# EAGLE design 280113_Battery_Connector_UEBK-30256_1.0 (EAGLE 9.6.2)
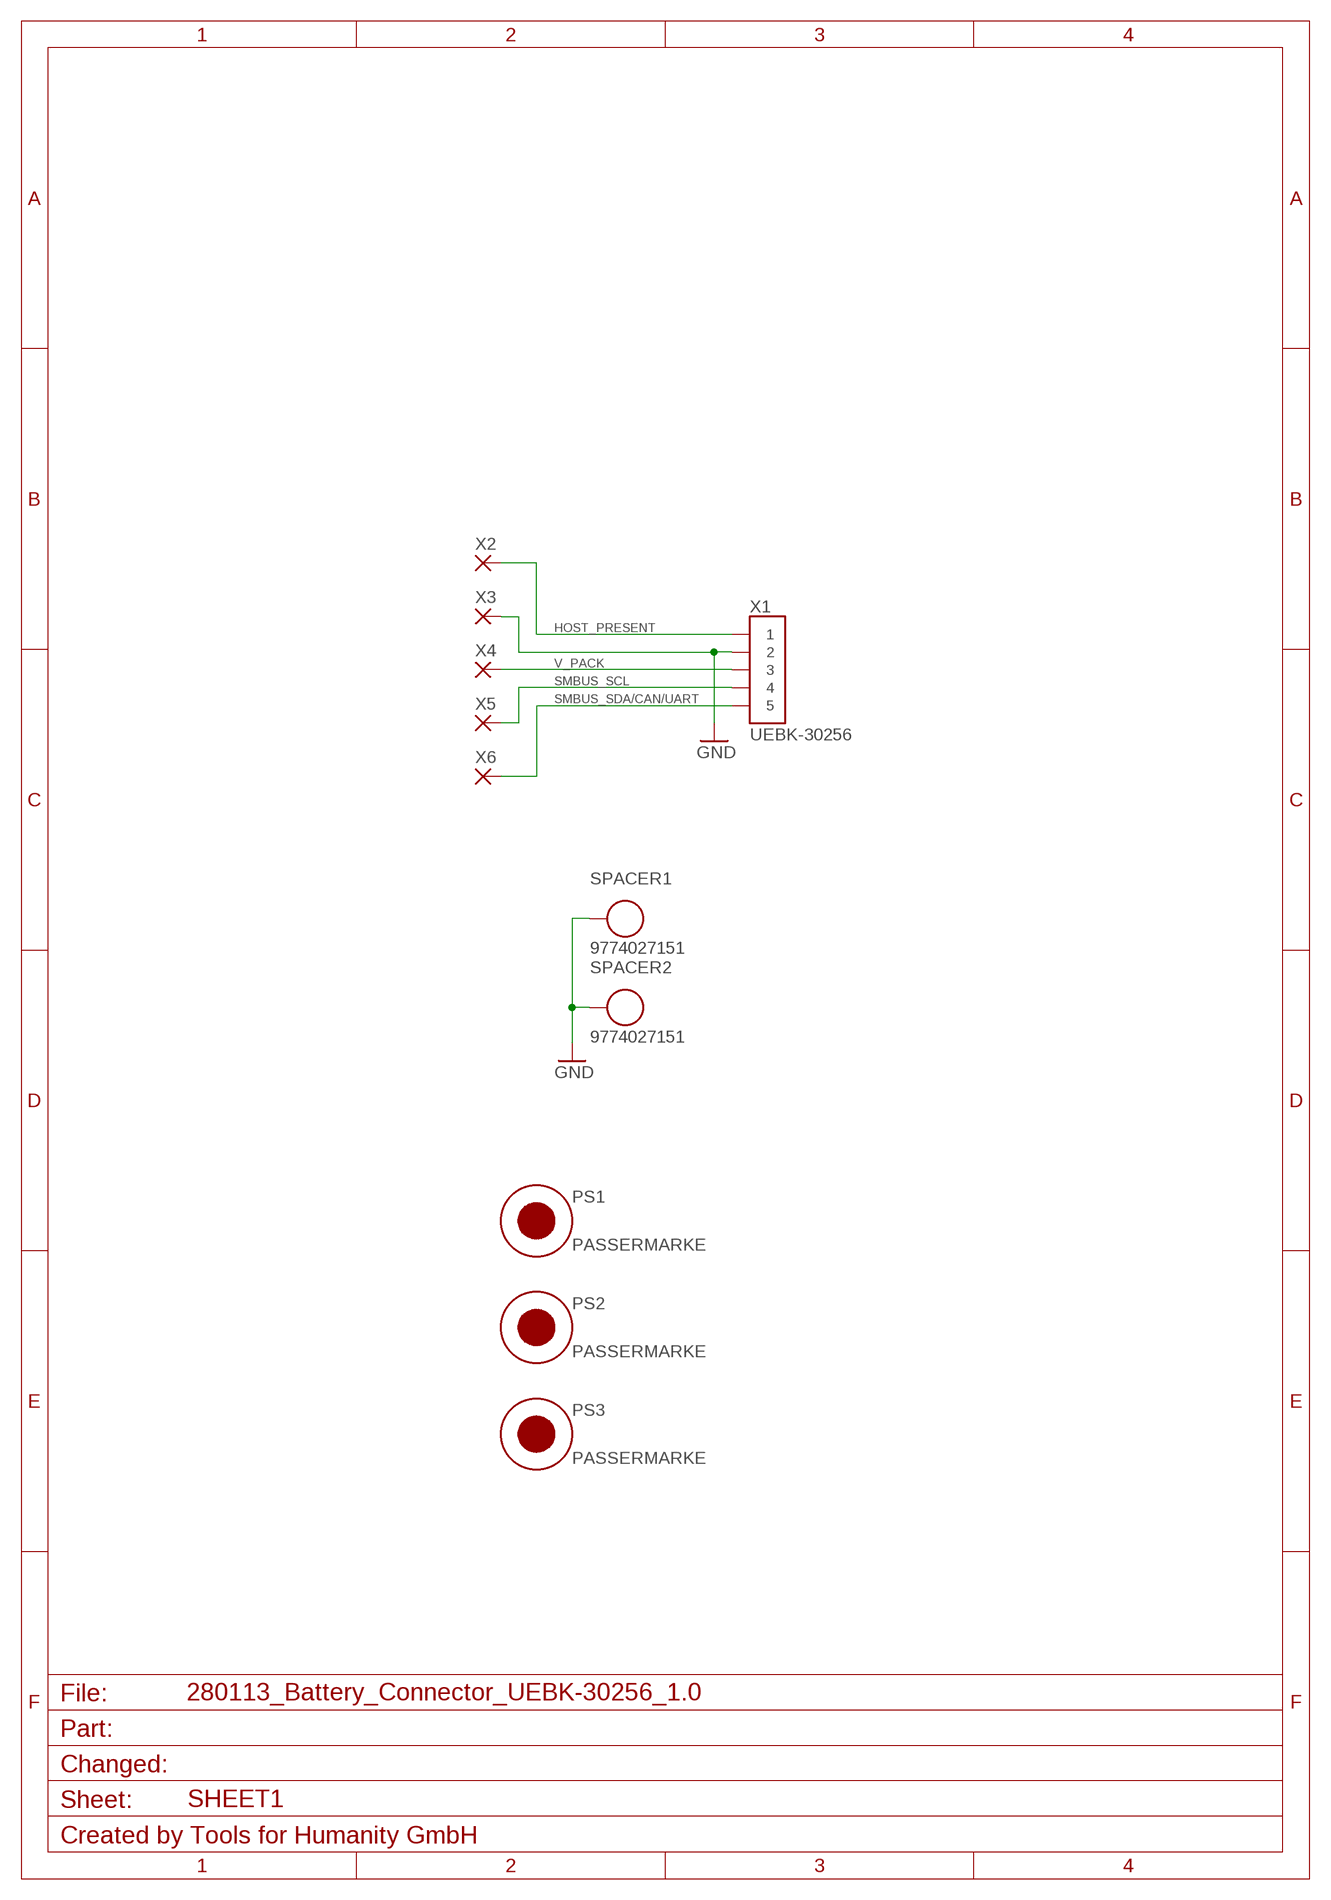
[diagram p0: schematic, sheet 1]

## Parts
PS1  PASSERMARKE  [PASSERMARKE]
PS2  PASSERMARKE  [PASSERMARKE]
PS3  PASSERMARKE  [PASSERMARKE]
SPACER1  9774027151  [WA-SMSI_9774027151_WUERTH]
SPACER2  9774027151  [WA-SMSI_9774027151_WUERTH]
X1  UEBK-30256  [UEBK-30256_UWE]
X2  PAD_RECT_VIAS_3.3X10.0MM_TOP_BOT  [PAD_RECT_VIAS_3.3X10.0MM_TOP_BOT]
X3  PAD_RECT_VIAS_3.3X10.0MM_TOP_BOT  [PAD_RECT_VIAS_3.3X10.0MM_TOP_BOT]
X4  PAD_RECT_VIAS_3.3X10.0MM_TOP_BOT  [PAD_RECT_VIAS_3.3X10.0MM_TOP_BOT]
X5  PAD_RECT_VIAS_3.3X10.0MM_TOP_BOT  [PAD_RECT_VIAS_3.3X10.0MM_TOP_BOT]
X6  PAD_RECT_VIAS_3.3X10.0MM_TOP_BOT  [PAD_RECT_VIAS_3.3X10.0MM_TOP_BOT]

## Nets
GND: SPACER1.2 SPACER1.3 SPACER2.2 SPACER2.3 X1.2 X3.1(P) X3.2(P) X3.P$1(P) X3.P$2(P) X3.P$3(P) X3.P$4(P) X3.P$5(P) X3.P$6(P) X3.P$7(P) X3.P$8(P) X3.P$9(P) X3.P$10(P) X3.P$11(P) X3.P$12(P) X3.P$13(P) X3.P$14(P) X3.P$15(P) X3.P$16(P) X3.P$17(P) X3.P$18(P) X3.P$19(P) X3.P$20(P) X3.P$21(P) X3.P$22(P) X3.P$23(P) X3.P$24(P) X3.P$25(P) X3.P$26(P) X3.P$27(P)
HOST_PRESENT: X1.1 X2.1(P) X2.2(P) X2.P$1(P) X2.P$2(P) X2.P$3(P) X2.P$4(P) X2.P$5(P) X2.P$6(P) X2.P$7(P) X2.P$8(P) X2.P$9(P) X2.P$10(P) X2.P$11(P) X2.P$12(P) X2.P$13(P) X2.P$14(P) X2.P$15(P) X2.P$16(P) X2.P$17(P) X2.P$18(P) X2.P$19(P) X2.P$20(P) X2.P$21(P) X2.P$22(P) X2.P$23(P) X2.P$24(P) X2.P$25(P) X2.P$26(P) X2.P$27(P)
SMBUS_SCL: X1.4 X5.1(P) X5.2(P) X5.P$1(P) X5.P$2(P) X5.P$3(P) X5.P$4(P) X5.P$5(P) X5.P$6(P) X5.P$7(P) X5.P$8(P) X5.P$9(P) X5.P$10(P) X5.P$11(P) X5.P$12(P) X5.P$13(P) X5.P$14(P) X5.P$15(P) X5.P$16(P) X5.P$17(P) X5.P$18(P) X5.P$19(P) X5.P$20(P) X5.P$21(P) X5.P$22(P) X5.P$23(P) X5.P$24(P) X5.P$25(P) X5.P$26(P) X5.P$27(P)
SMBUS_SDA/CAN/UART: X1.5 X6.1(P) X6.2(P) X6.P$1(P) X6.P$2(P) X6.P$3(P) X6.P$4(P) X6.P$5(P) X6.P$6(P) X6.P$7(P) X6.P$8(P) X6.P$9(P) X6.P$10(P) X6.P$11(P) X6.P$12(P) X6.P$13(P) X6.P$14(P) X6.P$15(P) X6.P$16(P) X6.P$17(P) X6.P$18(P) X6.P$19(P) X6.P$20(P) X6.P$21(P) X6.P$22(P) X6.P$23(P) X6.P$24(P) X6.P$25(P) X6.P$26(P) X6.P$27(P)
V_PACK: X1.3 X4.1(P) X4.2(P) X4.P$1(P) X4.P$2(P) X4.P$3(P) X4.P$4(P) X4.P$5(P) X4.P$6(P) X4.P$7(P) X4.P$8(P) X4.P$9(P) X4.P$10(P) X4.P$11(P) X4.P$12(P) X4.P$13(P) X4.P$14(P) X4.P$15(P) X4.P$16(P) X4.P$17(P) X4.P$18(P) X4.P$19(P) X4.P$20(P) X4.P$21(P) X4.P$22(P) X4.P$23(P) X4.P$24(P) X4.P$25(P) X4.P$26(P) X4.P$27(P)

## Library data of the parts
PS1-PS3 = 07_DT_Miscellaneous:PASSERMARKE; CHANGED: 2017-11-07; CREATED: 2017-11-07
SPACER1 SPACER2 = 00_DT_Connectors:9774027151: 9774027151 WA-SMSI SMT Steel Spacer, M2.5 Thread Internal, L = 2.7 mm; CHANGED: 2021-09-07; CREATED: 2021-09-07; MANUFACTURER: Wuerth; MAX_OP_TEMP: 150 °C; MIN_OP_TEMP: -55 °C; ROHS: yes; STATUS: active
X1 = 00_DT_Connectors:UEBK-30256: UEBK-30256, battery connector, 6.0 A; CHANGED: 2021-09-07; CREATED: 2021-09-07; CURRENT: 6.0 A; MANUFACTURER: uwe electronic GmbH; MAX_OP_TEMP: ???; MIN_OP_TEMP: ???; ROHS: yes; STATUS: active
X2-X6 = 00_DT_Connectors:PAD_RECT_VIAS_3.3X10.0MM_TOP_BOT: SMD Pad 3.3 mm x 10.0 mm Anschlusspad mit Vias zur Erhöhung der mechanischen Robustheit; CHANGED: 2021-09-13; CREATED: 2021-09-13

## Board
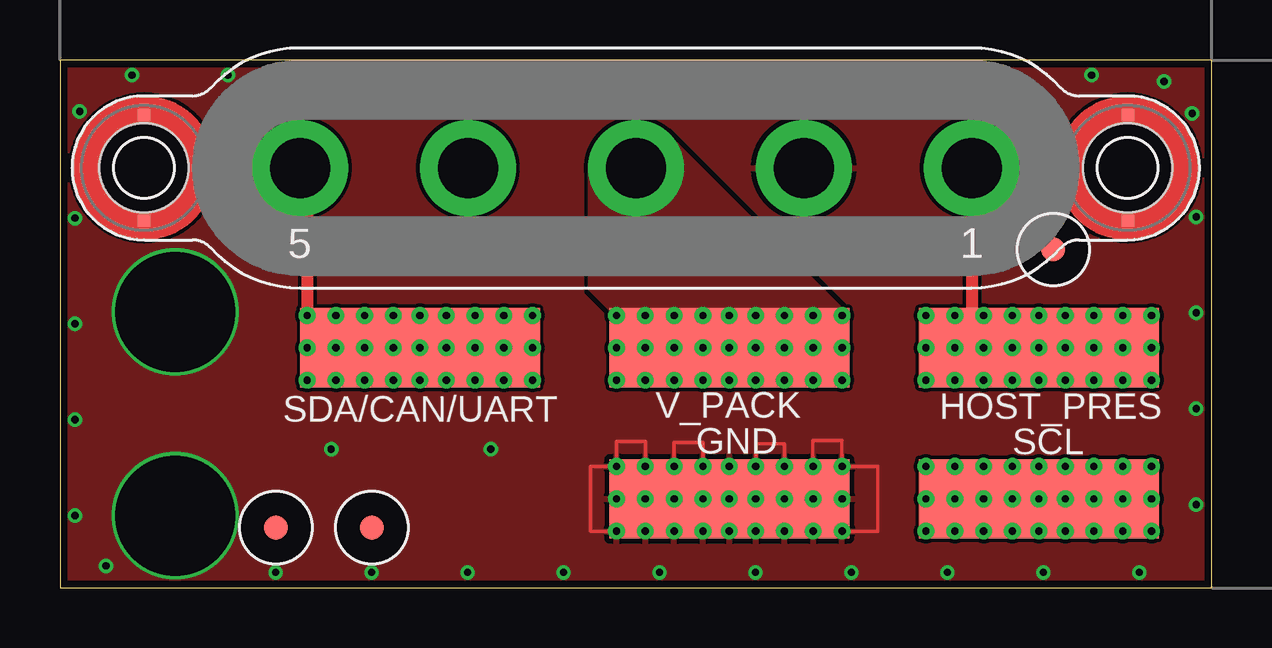
[diagram p1: board, top side]
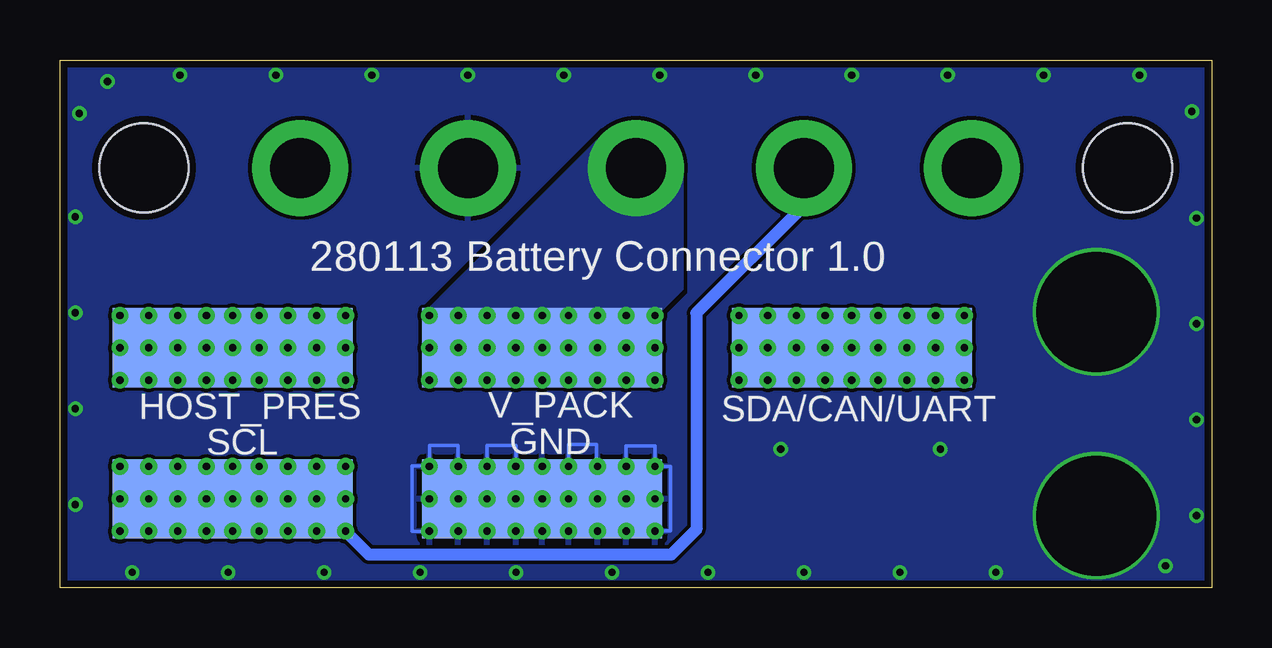
[diagram p2: board, bottom side, seen from below]

Size 48 x 22 mm. Coordinates in mm from the lower left corner, seen from the top.
Outline: 48,22 0,22 0,0 48,0 48,22
Copper layers (1*16): Top 0.035mm / dielectric 1.5mm / Bottom 0.035mm
Design rules "multi-cb_2L_035um-cu_150um_Strukturen": minimum track width 0.15mm, minimum drill 0.3mm, track to track 0.15mm, track to pad 0.15mm, pad to pad 0.15mm, via to via 0.15mm, smd to smd 0.15mm, copper to edge 0.3mm, drill to drill 0.2mm, minimum pad ring 0.2mm, minimum via ring 0.15mm, stop-mask expansion 0.05mm, vias tented up to drill 0.3mm, thermal gap 8mil

### Footprints (pad centres in the part's own frame; a part is rotated, then mirrored left to right if it is on the bottom)
PASSERMARKE = smd 1 x 1: P$1 0,0
WA-SMSI_9774027151_WUERTH = smd 0.5 x 0.5: 2 0,2.19; 3 0,-2.19 | hole 3.7: 0,0
UEBK-30256_UWE = drill 2.5 pad 4: 1 -14,0; 2 -7,0; 3 0,0; 4 7,0; 5 14,0
PAD_RECT_VIAS_3.3X10.0MM_TOP_BOT = smd 10 x 3.3: 1 0,0 | smd 10 x 3.3 bottom: 2 0,0 | drill 0.3 pad 0.6: P$1 -4.7,-1.35; P$2 -3.5,-1.35; P$3 -2.3,-1.35; P$4 -1.1,-1.35; P$5 0,-1.35; P$6 1.1,-1.35; P$7 2.3,-1.35; P$8 3.5,-1.35; P$9 4.7,-1.35; P$10 -4.7,1.35; P$11 -3.5,1.35; P$12 -2.3,1.35; P$13 -1.1,1.35; P$14 0,1.35; P$15 1.1,1.35; P$16 2.3,1.35; P$17 3.5,1.35; P$18 4.7,1.35; P$19 -3.5,0; P$20 -4.7,0; P$21 -2.3,0; P$22 -1.1,0; P$23 4.7,0; P$24 0,0; P$25 1.1,0; P$26 2.3,0; P$27 3.5,0

### Placement (x,y rotation side)
PS1  41.4,14.1 0 top
PS2  9,2.5 0 top
PS3  13,2.5 0 top
SPACER1  3.5,17.5 0 top
SPACER2  44.5,17.5 0 top
X1  24,17.5 180 top
X2  40.8,10 0 top
X3  27.9,3.7 0 top
X4  27.9,10 180 top
X5  40.8,3.7 0 top
X6  15,10 0 top

### Tracks (layer width: path | path; a pad name or v marks a point on that pad's centre or on a via)
GND  (via drill 0.3, 5)
  Top 0.15: X3.2 X3.P$20 23.2,6.09 24.4,6.09 X3.P$11 | X3.2 X3.P$21 25.6,6.05 26.8,6.05 X3.P$13 | X3.2 X3.P$25 29,5.99 30.2,5.99 X3.P$16 | X3.2 X3.P$27 31.39,6.12 32.6,6.12 X3.P$18 | X3.2 X3.P$14 | X3.P$14 34.1,5.04 34.1,2.35 X3.P$9 | X3.2 X3.P$14 | X3.P$14 22.12,5.04 22.12,2.35 X3.P$1
  Bottom 0.15: X3.2 X3.P$5 22.54,2.36 22.54,5.05 X3.P$10 | X3.2 23.19,3.7 23.19,5.9 24.4,5.9 X3.P$11 | X3.2 25.64,3.7 25.64,5.97 26.8,5.97 X3.P$13 | X3.2 X3.P$25 28.99,5.93 30.2,5.93 X3.P$16 | X3.2 X3.P$27 31.4,5.93 32.6,5.93 X3.P$18 | X3.2 27.9,5.06 33.33,5.06 33.33,2.35 X3.P$9
  other vias: 4.8,11.5 4.8,3 0.82,19.86 3,21.37 7,21.37 11,21.37 15,21.37 19,21.37 23,21.37 27,21.37 31,21.37 35,21.37 39,21.37 43,21.37 47.2,19.77 46.02,21.11 47.36,15.46 47.36,11.46 47.36,7.46 47.36,3.46 44.99,0.63 40.99,0.63 36.99,0.63 32.99,0.63 28.99,0.63 24.99,0.63 20.99,0.63 16.99,0.63 12.99,0.63 8.99,0.63 0.62,3 1.92,0.9 0.62,11 0.62,7 0.63,15.4 11.31,5.77 17.95,5.77
  pour Top (rank 6): 0.15,21.85 47.85,21.85 47.85,0.17 0.15,0.17
  pour Bottom (rank 6): 0.15,21.85 47.85,21.85 47.85,0.17 0.15,0.17
  pour Top (no thermals): 23.03,5.19 32.76,5.19 32.76,2.21 23.02,2.21 23.02,5.14
  pour Top (no thermals): 0.15,21.85 6.9,21.85 6.9,13.9 0.15,13.9
  pour Top (no thermals): 41.1,21.85 47.85,21.85 47.85,13.9 41.1,13.9
HOST_PRESENT
  Top 0.5: X1.1 38,10.5 X2.P$21
  pour Top (no thermals): 35.93,11.51 45.67,11.51 45.67,8.46 35.94,8.46 35.94,11.45
SMBUS_SCL
  Bottom 0.5: X1.4 17,15.92 21.48,11.44 21.48,2.42 22.53,1.37 35.12,1.37 X5.P$1
  pour Top (no thermals): 35.93,5.21 45.65,5.21 45.65,2.22 35.91,2.22 35.91,5.16
SMBUS_SDA/CAN/UART
  Top 0.5: X1.5 10.3,17.2 X6.P$10
  pour Top (no thermals): 10.1,11.51 19.9,11.51 19.9,8.44 10.1,8.44 10.1,11.47
V_PACK
  pour Top (no thermals): 22.08,17.56 22.08,12.44 22.99,11.53 22.99,8.73 23.27,8.45 32.44,8.45 32.79,8.8 32.79,11.44 32.69,11.54 32.65,11.54 25.27,18.92 23.19,18.92 22.14,17.88
  pour Bottom (no thermals): 22.08,17.56 22.08,12.44 22.99,11.53 22.99,8.73 23.27,8.45 32.44,8.45 32.79,8.8 32.79,11.44 32.69,11.54 32.65,11.54 25.27,18.92 23.19,18.92 22.14,17.88

### Text on the board
tPlace: SDA/CAN/UART | V_PACK | HOST_PRES | GND | SCL
bPlace: 280113 Battery Connector 1.0 | SDA/CAN/UART | V_PACK | HOST_PRES | GND | SCL